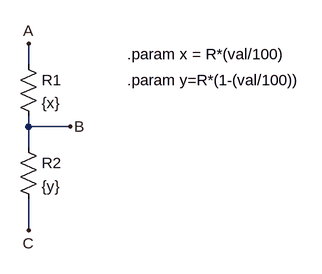
[diagram p0: schematic potentiometer.asc]
potentiometer.asc, the LTspice schematic file:
Version 4
SHEET 1 880 680
WIRE 192 64 192 32
WIRE 192 160 192 144
WIRE 256 160 192 160
WIRE 192 192 192 160
WIRE 192 320 192 272
FLAG 192 32 A
FLAG 256 160 B
FLAG 192 320 C
SYMBOL res 176 48 R0
SYMATTR InstName R1
SYMATTR Value {x}
SYMBOL res 176 176 R0
SYMATTR InstName R2
SYMATTR Value {y}
TEXT 344 48 Left 2 !.param x = R*(val/100)
TEXT 344 88 Left 2 !.param y=R*(1-(val/100))

The netlist it stands for:
* potentiometer.asc
R1 A B {x}
R2 B C {y}
.param x = R*(val/100)
.param y=R*(1-(val/100))
.backanno
.end